# EAGLE schematic Mainboard (EAGLE 6.1)
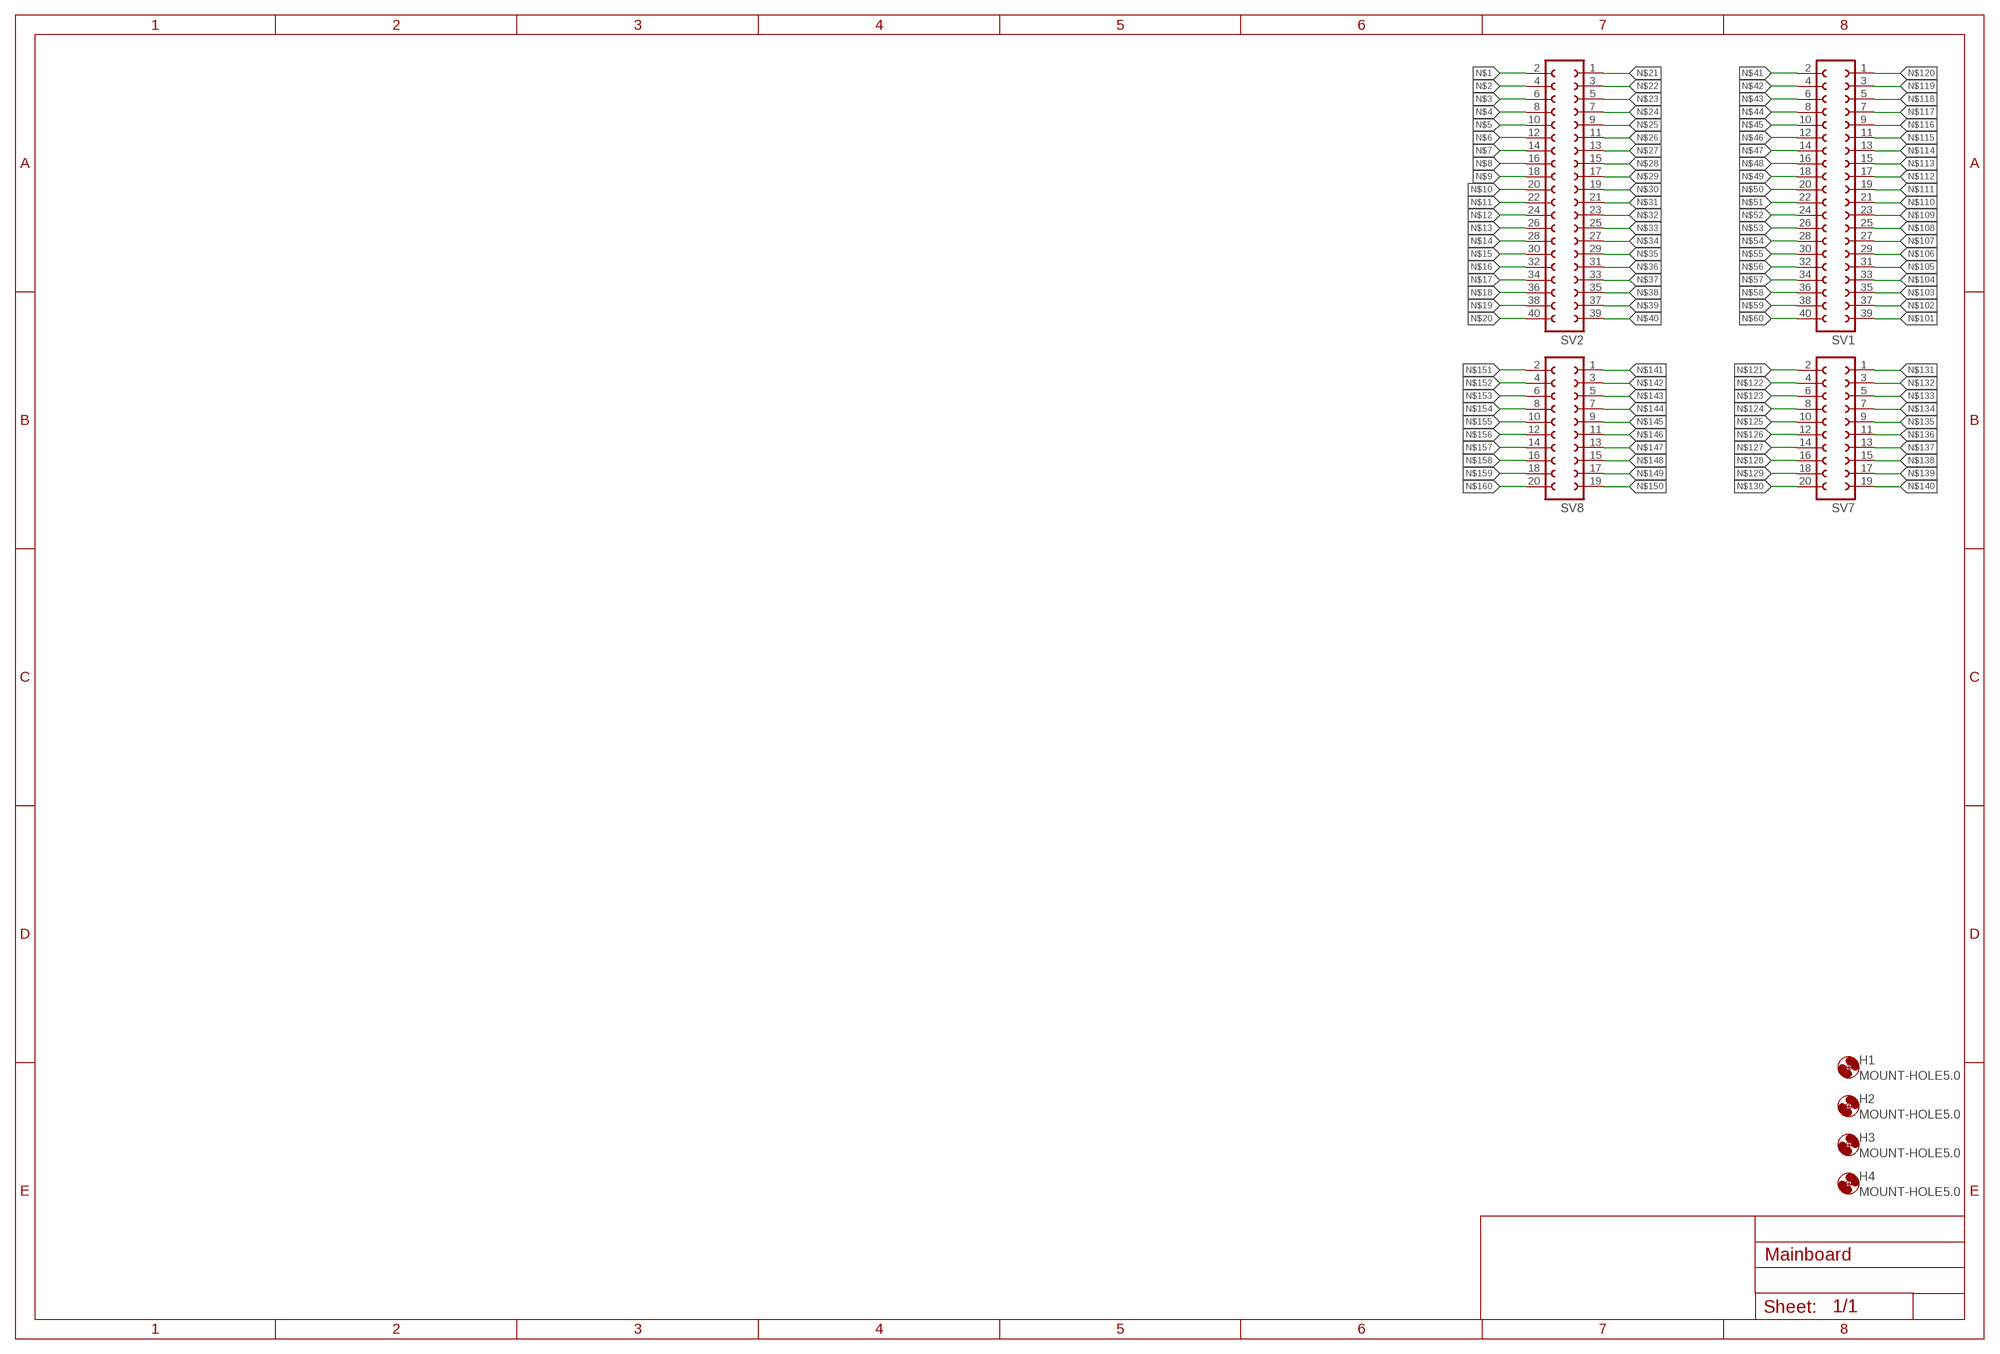
[diagram p0: schematic, sheet 1]

## Parts
H1  MOUNT-HOLE5.0  [5,0]
H2  MOUNT-HOLE5.0  [5,0]
H3  MOUNT-HOLE5.0  [5,0]
H4  MOUNT-HOLE5.0  [5,0]
SV1  FE20-2  [FE20-2]
SV2  FE20-2  [FE20-2]
SV7  FE10-2  [FE10-2]
SV8  FE10-2  [FE10-2]

## Nets
N$1: SV2.2
N$2: SV2.4
N$3: SV2.6
N$4: SV2.8
N$5: SV2.10
N$6: SV2.12
N$7: SV2.14
N$8: SV2.16
N$9: SV2.18
N$10: SV2.20
N$11: SV2.22
N$12: SV2.24
N$13: SV2.26
N$14: SV2.28
N$15: SV2.30
N$16: SV2.32
N$17: SV2.34
N$18: SV2.36
N$19: SV2.38
N$20: SV2.40
N$21: SV2.1
N$22: SV2.3
N$23: SV2.5
N$24: SV2.7
N$25: SV2.9
N$26: SV2.11
N$27: SV2.13
N$28: SV2.15
N$29: SV2.17
N$30: SV2.19
N$31: SV2.21
N$32: SV2.23
N$33: SV2.25
N$34: SV2.27
N$35: SV2.29
N$36: SV2.31
N$37: SV2.33
N$38: SV2.35
N$39: SV2.37
N$40: SV2.39
N$41: SV1.2
N$42: SV1.4
N$43: SV1.6
N$44: SV1.8
N$45: SV1.10
N$46: SV1.12
N$47: SV1.14
N$48: SV1.16
N$49: SV1.18
N$50: SV1.20
N$51: SV1.22
N$52: SV1.24
N$53: SV1.26
N$54: SV1.28
N$55: SV1.30
N$56: SV1.32
N$57: SV1.34
N$58: SV1.36
N$59: SV1.38
N$60: SV1.40
N$101: SV1.39
N$102: SV1.37
N$103: SV1.35
N$104: SV1.33
N$105: SV1.31
N$106: SV1.29
N$107: SV1.27
N$108: SV1.25
N$109: SV1.23
N$110: SV1.21
N$111: SV1.19
N$112: SV1.17
N$113: SV1.15
N$114: SV1.13
N$115: SV1.11
N$116: SV1.9
N$117: SV1.7
N$118: SV1.5
N$119: SV1.3
N$120: SV1.1
N$121: SV7.2
N$122: SV7.4
N$123: SV7.6
N$124: SV7.8
N$125: SV7.10
N$126: SV7.12
N$127: SV7.14
N$128: SV7.16
N$129: SV7.18
N$130: SV7.20
N$131: SV7.1
N$132: SV7.3
N$133: SV7.5
N$134: SV7.7
N$135: SV7.9
N$136: SV7.11
N$137: SV7.13
N$138: SV7.15
N$139: SV7.17
N$140: SV7.19
N$141: SV8.1
N$142: SV8.3
N$143: SV8.5
N$144: SV8.7
N$145: SV8.9
N$146: SV8.11
N$147: SV8.13
N$148: SV8.15
N$149: SV8.17
N$150: SV8.19
N$151: SV8.2
N$152: SV8.4
N$153: SV8.6
N$154: SV8.8
N$155: SV8.10
N$156: SV8.12
N$157: SV8.14
N$158: SV8.16
N$159: SV8.18
N$160: SV8.20

## Library data of the parts
H1-H4 = holes:MOUNT-HOLE: MOUNTING HOLE with drill center marker
SV1 SV2 = con-lsta:FE20-2: FEMALE HEADER; OC_FARNELL: unknown; OC_NEWARK: unknown
SV7 SV8 = con-lsta:FE10-2: FEMALE HEADER; OC_FARNELL: unknown; OC_NEWARK: unknown